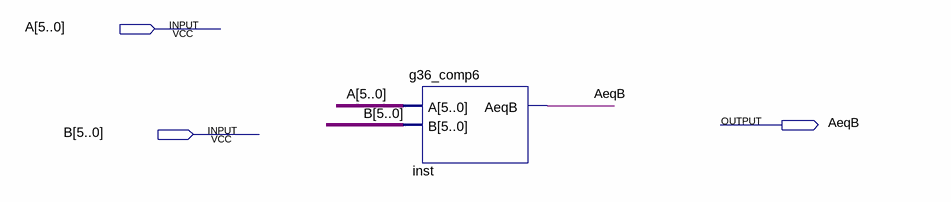
[diagram p0: schematic sheet]
// Quartus schematic g36_lab1.bdf as structural Verilog: 1 symbols, 3 pins
module g36_lab1 (
  input  [5:0] A,
  input  [5:0] B,
  output AeqB
);

  g36_comp6 inst (.A(A), .B(B), .AeqB(AeqB));
endmodule
